# EAGLE schematic sketchy_060426 (EAGLE 4.16)
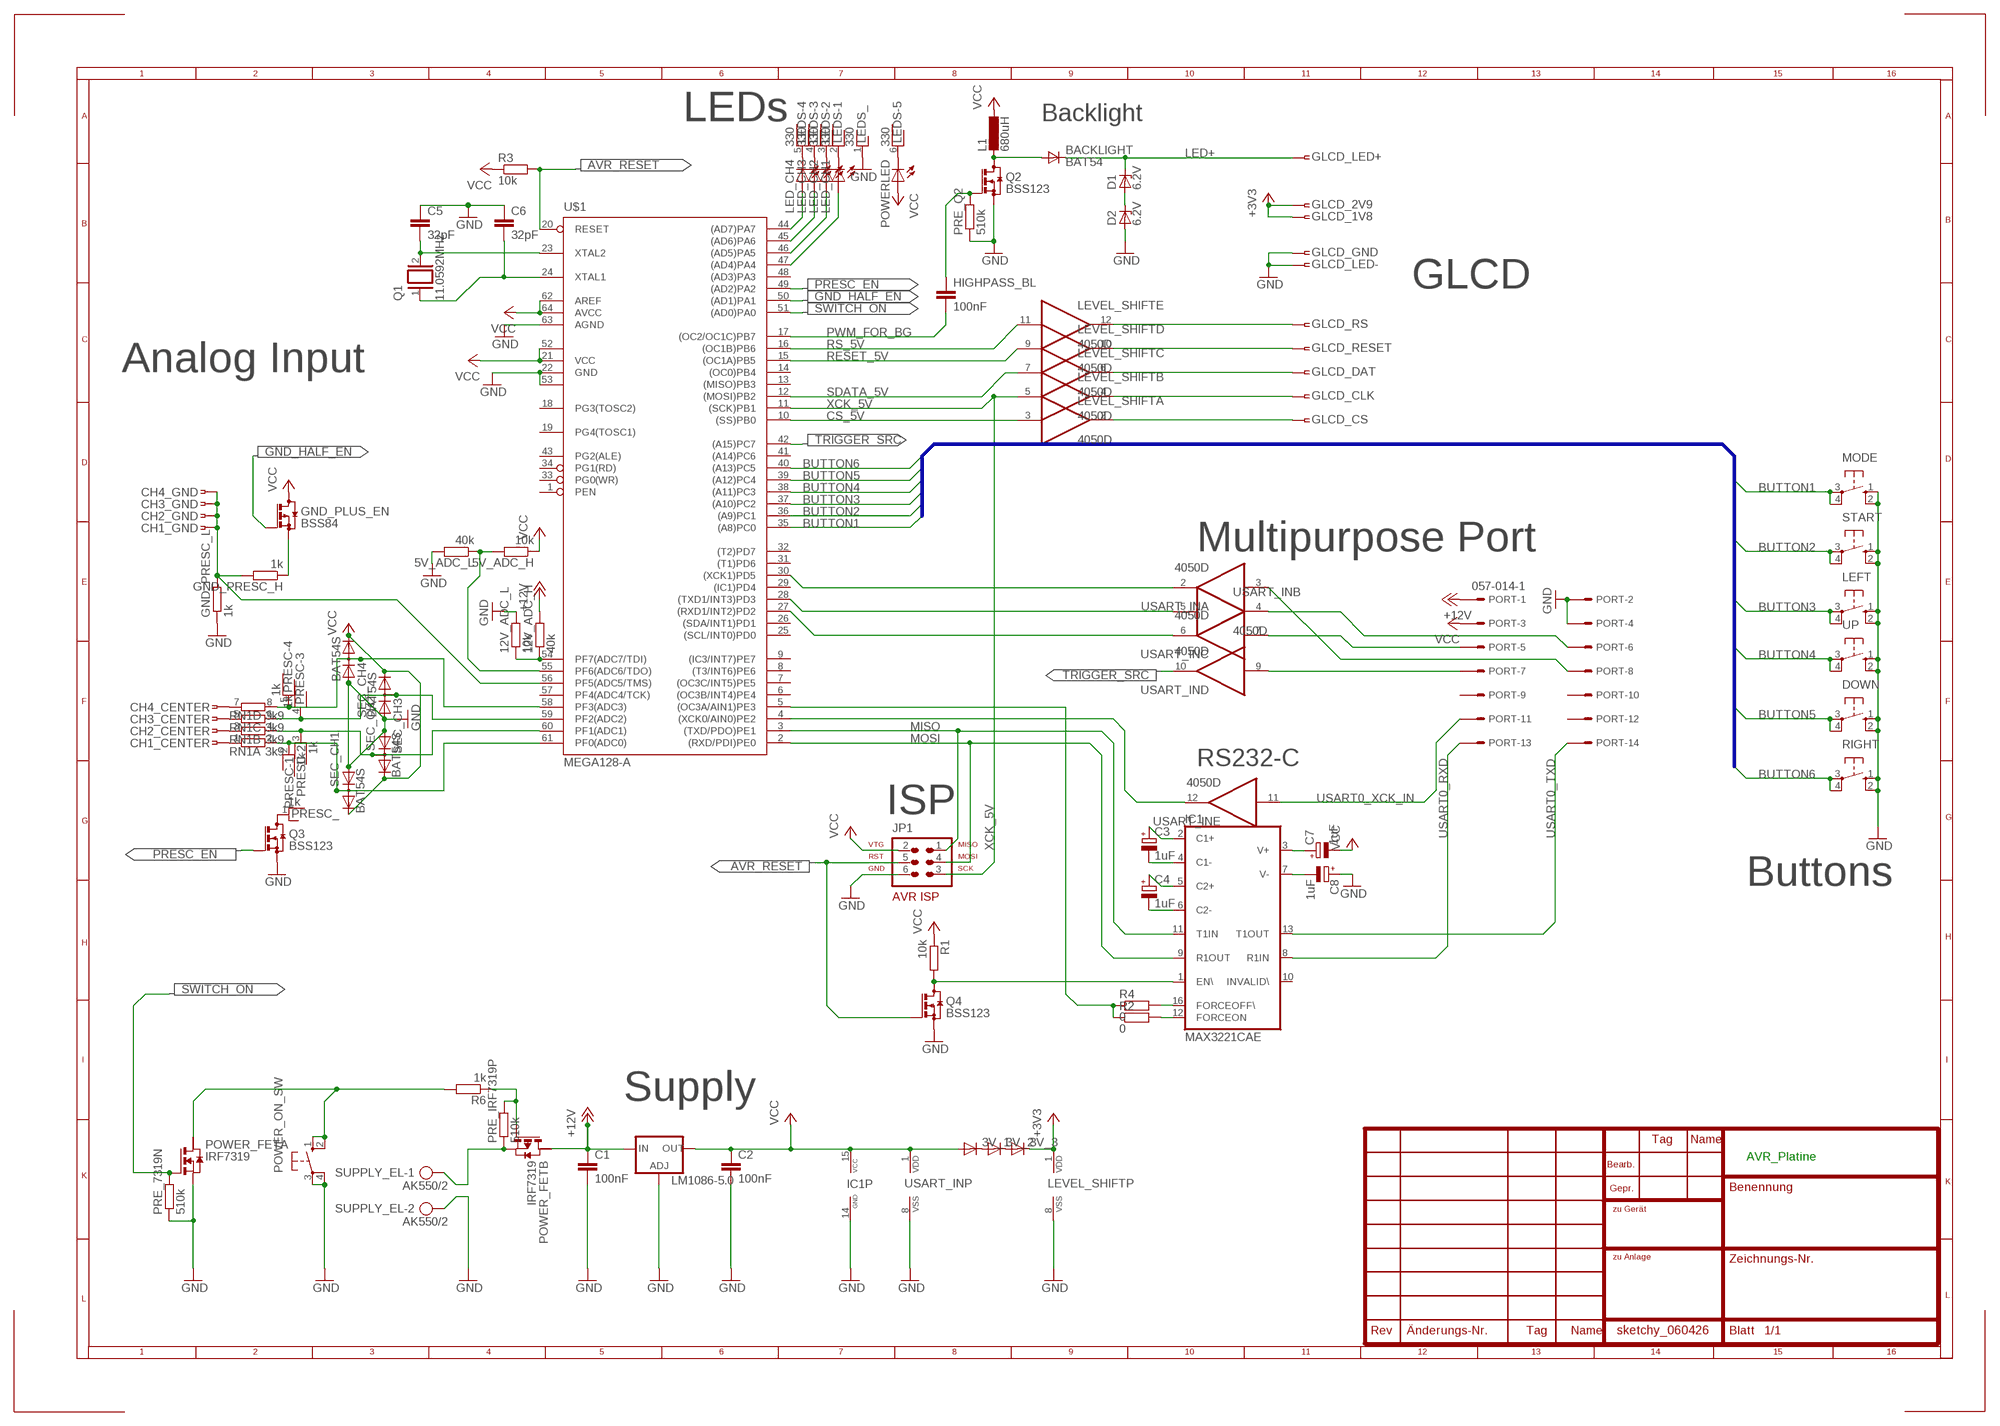
[diagram p0: schematic, sheet 1]

## Parts
3V_1  DIODE-MINIMELF  [MINIMELF]
3V_2  DIODE-MINIMELF  [MINIMELF]
3V_3  DIODE-MINIMELF  [MINIMELF]
5V_ADC_H  10k  R-EU_R0805  [R0805]
5V_ADC_L  40k  R-EU_R0805  [R0805]
12V_ADC_H  40k  R-EU_R0805  [R0805]
12V_ADC_L  10k  R-EU_R0805  [R0805]
BACKLIGHT  BAT54  DSOT23  [SOT-23]
C1  100nF  C-EU050-025X075  [C050-025X075]
C2  100nF  C-EU050-025X075  [C050-025X075]
C3  1uF  CPOL-EU153CLV-0405  [153CLV-0405]
C4  1uF  CPOL-EU153CLV-0405  [153CLV-0405]
C5  32pF  C-EUC0805  [C0805]
C6  32pF  C-EUC0805  [C0805]
C7  1uF  CPOL-EU153CLV-0405  [153CLV-0405]
C8  1uF  CPOL-EU153CLV-0405  [153CLV-0405]
CH1  BNC_GEWINKELT  [BNC]
CH2  BNC_GEWINKELT  [BNC]
CH3  BNC_GEWINKELT  [BNC]
CH4  BNC_GEWINKELT  [BNC]
D1  6.2V  ZENER-DIODESOT23  [SOT23]
D2  6.2V  ZENER-DIODESOT23  [SOT23]
DOWN  10-XX  [B3F-10XX]
GLCD  GLCD_S65  [GLCD_S65]
GND_PLUS_EN  BSS84  [SOT23]
GND_PRESC_H  1k  R-EU_R0805  [R0805]
GND_PRESC_L  1k  R-EU_R0805  [R0805]
HIGHPASS_BL  100nF  C-EU050-025X075  [C050-025X075]
IC1  MAX3221CAE  [SSOP16]
JP1  AVR-ISP-6  [AVR-ISP-6]
L1  680uH  L-EU2200-12.7  [2200-12.7]
LED_CH1  LEDCHIPLED_0805  [CHIPLED_0805]
LED_CH2  LEDCHIPLED_0805  [CHIPLED_0805]
LED_CH3  LEDCHIPLED_0805  [CHIPLED_0805]
LED_CH4  LEDCHIPLED_0805  [CHIPLED_0805]
LEDS  330  RNX5  [RN-6]
LEFT  10-XX  [B3F-10XX]
LEVEL_SHIFT  4050D  [SO16]
LM1086-5.0  LM317TL  [317TL]
MODE  10-XX  [B3F-10XX]
PORT  057-014-1  [057-014-1]
POWER_FET  IRF7319  PN_MOSFET-SO8  [SO8]
POWER_ON_SW  10-XX  [B3F-10XX]
POWERLED  LEDCHIPLED_0805  [CHIPLED_0805]
PRE_7319N  510k  R-EU_R0805  [R0805]
PRE_IRF7319P  510k  R-EU_R0805  [R0805]
PRE_Q2  510k  R-EU_R0805  [R0805]
PRESC  1k  RNX4  [RN-5]
Q1  11.0592MHz  XTAL/S  [QS]
Q2  BSS123  [SOT23]
Q3  BSS123  [SOT23]
Q4  BSS123  [SOT23]
R1  10k  R-EU_R0805  [R0805]
R2  0  R-EU_R0805  [R0805]
R3  10k  R-EU_R0805  [R0805]
R4  0  R-EU_R0805  [R0805]
R6  1k  R-EU_R0805  [R0805]
RIGHT  10-XX  [B3F-10XX]
RN1  3k9  E4R  [SIL8]
SEC_CH1  BAT54S  DIODE_2CACA-SOT23  [SOT23]
SEC_CH2  BAT54S  DIODE_2CACA-SOT23  [SOT23]
SEC_CH3  BAT54S  DIODE_2CACA-SOT23  [SOT23]
SEC_CH4  BAT54S  DIODE_2CACA-SOT23  [SOT23]
START  10-XX  [B3F-10XX]
SUPPLY_EL  AK550/2  [AK550/2]
U$1  MEGA128-A  [TQFP64]
UP  10-XX  [B3F-10XX]
USART_IN  4050D  [SO16]

## Nets
+3V3: 3V_3.C GLCD.6 GLCD.8 LEVEL_SHIFT.1(P:VDD)
+12V: 12V_ADC_H.2 C1.1 LM1086-5.0.3(IN) PORT.1 POWER_FET.5(B:D)
AVR_RESET: JP1.5 Q4.1(G) R3.2 U$1.20(RESET)
BUTTON1: MODE.3(P) MODE.4(P1) U$1.35((A8)PC0)
BUTTON2: START.3(P) START.4(P1) U$1.36((A9)PC1)
BUTTON3: LEFT.3(P) LEFT.4(P1) U$1.37((A10)PC2)
BUTTON4: U$1.38((A11)PC3) UP.3(P) UP.4(P1)
BUTTON5: DOWN.3(P) DOWN.4(P1) U$1.39((A12)PC4)
BUTTON6: RIGHT.3(P) RIGHT.4(P1) U$1.40((A13)PC5)
CS_5V: LEVEL_SHIFT.3(A:I) U$1.10((SS)PB0)
GND: 5V_ADC_L.2 12V_ADC_L.2 C1.2 C2.2 C5.1 C6.1 C8.+ D2.1(A) DOWN.1(S) DOWN.2(S1) GLCD.7 GLCD.10 GND_PRESC_L.1 IC1.14(GND) JP1.6 LEDS.1 LEFT.1(S) LEFT.2(S1) LEVEL_SHIFT.8(P:VSS) LM1086-5.0.1(ADJ) MODE.1(S) MODE.2(S1) PORT.2 PORT.4 POWER_FET.1(A:S) POWER_ON_SW.3(P) POWER_ON_SW.4(P1) PRE_7319N.1 PRE_Q2.1 Q2.2(S) Q3.2(S) Q4.2(S) RIGHT.1(S) RIGHT.2(S1) SEC_CH1.1(A) SEC_CH2.1(A) SEC_CH3.1(A) SEC_CH4.1(A) START.1(S) START.2(S1) SUPPLY_EL.2 U$1.22(GND) U$1.53(GND1) U$1.63(AGND) UP.1(S) UP.2(S1) USART_IN.8(P:VSS)
GND_HALF_EN: GND_PLUS_EN.1(G) U$1.50((AD1)PA1)
LED+: BACKLIGHT.1(C) D1.3(C) GLCD.9
MISO: IC1.11(T1IN) JP1.1 U$1.3((TXD/PDO)PE1)
MOSI: IC1.9(R1OUT) JP1.4 U$1.2((RXD/PDI)PE0)
N$1: CH1.CENTER RN1.1
N$2: 12V_ADC_H.1 12V_ADC_L.1 U$1.54(PF7(ADC7/TDI))
N$3: BACKLIGHT.3(A) L1.2 Q2.3(D)
N$4: LEDS.6 POWERLED.C
N$5: D1.1(A) D2.3(C)
N$6: 3V_1.C 3V_2.A
N$7: 3V_2.C 3V_3.A
N$8: C8.- IC1.7(V-)
N$9: POWER_FET.4(B:G) PRE_IRF7319P.2 R6.1
N$10: C5.2 Q1.2 U$1.23(XTAL2)
N$11: C6.2 Q1.1 U$1.24(XTAL1)
N$12: GND_PLUS_EN.2(S) GND_PRESC_H.1
N$13: U$1.30((XCK1)PD5) USART_IN.2(A:O)
N$14: CH2.CENTER RN1.3
N$15: POWER_FET.3(B:S) PRE_IRF7319P.1 SUPPLY_EL.1
N$16: U$1.28((TXD1/INT3)PD3) USART_IN.5(B:I)
N$17: U$1.27((RXD1/INT2)PD2) USART_IN.6(C:O)
N$18: GLCD.1 LEVEL_SHIFT.12(E:O)
N$19: GLCD.2 LEVEL_SHIFT.10(D:O)
N$20: GLCD.3 LEVEL_SHIFT.2(A:O)
N$21: GLCD.4 LEVEL_SHIFT.4(B:O)
N$22: CH3.CENTER RN1.5
N$23: GLCD.5 LEVEL_SHIFT.6(C:O)
N$24: CH4.CENTER RN1.7
N$25: LED_CH1.C LEDS.2
N$26: PRESC.2 RN1.2 SEC_CH1.3(AC) U$1.61(PF0(ADC0))
N$27: PRESC.3 RN1.4 SEC_CH2.3(AC) U$1.60(PF1(ADC1))
N$28: PRESC.4 RN1.6 SEC_CH3.3(AC) U$1.59(PF2(ADC2))
N$29: PRESC.5 RN1.8 SEC_CH4.3(AC) U$1.58(PF3(ADC3))
N$30: PORT.6 USART_IN.4(B:O)
N$31: LED_CH2.C LEDS.3
N$32: PORT.5 USART_IN.7(C:I)
N$33: LED_CH3.C LEDS.4
N$34: PORT.8 USART_IN.3(A:I)
N$35: PORT.7 USART_IN.9(D:I)
N$36: 5V_ADC_H.2 5V_ADC_L.1 U$1.55(PF6(ADC6/TDO))
N$37: LED_CH1.A U$1.47((AD4)PA4)
N$38: LED_CH2.A U$1.46((AD5)PA5)
N$39: LED_CH3.A U$1.45((AD6)PA6)
N$40: LED_CH4.A U$1.44((AD7)PA7)
N$41: LED_CH4.C LEDS.5
N$42: POWER_FET.7(A:D) POWER_ON_SW.1(S) POWER_ON_SW.2(S1) R6.2
N$43: PRESC.1 Q3.3(D)
N$44: CH1.GND CH2.GND CH3.GND CH4.GND GND_PRESC_H.2 GND_PRESC_L.2 U$1.56(PF5(ADC5/TMS))
N$45: C3.+ IC1.2(C1+)
N$46: C3.- IC1.4(C1-)
N$47: C4.+ IC1.5(C2+)
N$48: C4.- IC1.6(C2-)
N$49: C7.+ IC1.3(V+)
N$50: IC1.1(EN\) Q4.3(D) R1.2
N$51: HIGHPASS_BL.1 PRE_Q2.2 Q2.1(G)
N$53: IC1.12(FORCEON) R2.2
N$54: U$1.4((XCK0/AIN0)PE2) USART_IN.12(E:O)
N$55: IC1.16(FORCEOFF\) R4.2
N$56: R2.1 R4.1 U$1.5((OC3A/AIN1)PE3)
PRESC_EN: Q3.1(G) U$1.49((AD2)PA2)
PWM_FOR_BG: HIGHPASS_BL.2 U$1.17((OC2/OC1C)PB7)
RESET_5V: LEVEL_SHIFT.9(D:I) U$1.15((OC1A)PB5)
RS_5V: LEVEL_SHIFT.11(E:I) U$1.16((OC1B)PB6)
SDATA_5V: LEVEL_SHIFT.7(C:I) U$1.12((MOSI)PB2)
SWITCH_ON: POWER_FET.2(A:G) PRE_7319N.2 U$1.51((AD0)PA0)
TRIGGER_SRC: U$1.42((A15)PC7) USART_IN.10(D:O)
USART0_RXD: IC1.8(R1IN) PORT.13
USART0_TXD: IC1.13(T1OUT) PORT.14
USART0_XCK_IN: PORT.11 USART_IN.11(E:I)
VCC: 3V_1.A 5V_ADC_H.1 C2.1 C7.- GND_PLUS_EN.3(D) IC1.15(VCC) JP1.2 L1.1 LM1086-5.0.2(OUT) PORT.3 POWERLED.A R1.1 R3.1 SEC_CH1.2(C) SEC_CH2.2(C) SEC_CH3.2(C) SEC_CH4.2(C) U$1.21(VCC) U$1.52(VCC1) U$1.62(AREF) U$1.64(AVCC) USART_IN.1(P:VDD)
XCK_5V: JP1.3 LEVEL_SHIFT.5(B:I) U$1.11((SCK)PB1)
Unconnected: IC1.10(INVALID\) LEVEL_SHIFT.14(F:I) LEVEL_SHIFT.15(F:O) PORT.9 PORT.10 PORT.12 POWER_FET.6(B:D2) POWER_FET.8(A:D2) U$1.1(PEN) U$1.6((OC3B/INT4)PE4) U$1.7((OC3C/INT5)PE5) U$1.8((T3/INT6)PE6) U$1.9((IC3/INT7)PE7) U$1.13((MISO)PB3) U$1.14((OC0)PB4) U$1.18(PG3(TOSC2)) U$1.19(PG4(TOSC1)) U$1.25((SCL/INT0)PD0) U$1.26((SDA/INT1)PD1) U$1.29((IC1)PD4) U$1.31((T1)PD6) U$1.32((T2)PD7) U$1.33(PG0(WR)) U$1.34(PG1(RD)) U$1.41((A14)PC6) U$1.43(PG2(ALE)) U$1.48((AD3)PA3) U$1.57(PF4(ADC4/TCK)) USART_IN.14(F:I) USART_IN.15(F:O)

## Buses
BUTTON[1..6]

## Notes on the sheet
- LEDs | Backlight
- GLCD
- Analog Input
- Multipurpose Port
- RS232-C
- ISP
- Buttons
- Supply
- AVR_Platine

## Library data of the parts
3V_1-3V_3 = diode:DIODE-: DIODE
5V_ADC_H 5V_ADC_L 12V_ADC_H 12V_ADC_L GND_PRESC_H GND_PRESC_L PRE_7319N PRE_IRF7319P PRE_Q2 R1-R4 R6 = rcl:R-EU_: RESISTOR, European symbol
BACKLIGHT = zetex:D: DIODE
C1 C2 C5 C6 HIGHPASS_BL = rcl:C-EU: CAPACITOR, European symbol
C3 C4 C7 C8 = rcl:CPOL-EU: POLARIZED CAPACITOR, European symbol
CH1-CH4 = zween:BNC_GEWINKELT
D1 D2 = diode:ZENER-DIODE: Z-Diode
DOWN LEFT MODE POWER_ON_SW RIGHT START UP = switch-omron:10-XX: OMRON SWITCH
GLCD = zween:GLCD_S65: package for GLCD from Siemens S65
GND_PLUS_EN = transistor-small-signal:BSS84: P-CHANNEL MOS FET
IC1 = maxim:MAX3221*: RS-232 Transceivers with AutoShutdown 1µA Supply-Current, True +3V to +5.5V http://dbserv.maxim-ic.com/
JP1 = atmel:AVR-ISP-6: AVR ISP-6 Serial Programming Header
L1 = rcl:L-EU: INDUCTOR, European symbol
LED_CH1-LED_CH4 POWERLED = led:LED: LED OSRAM: - CHIPLED LG R971, LG N971, LY N971, LG Q971, LY Q971, LO R971, LY R971 LH N974, LH R974 LS Q976, LO Q976, LY Q976 LO Q996 - Hyper CHIPLED LW Q18S LB Q993, LB Q99A, LB R99A - SideLED LS A670, LO A670, LY A670, LG A670, LP A670 LB A673, LV A673, LT A673, LW A673 LH A674 LY A675 LS A676, LA A676, LO A676, LY A676, LW A676 LS A679, LY A679, LG A679 - Hyper Micro SIDELED® LS Y876, LA Y876, LO Y876, LY Y876 LT Y87S - SmartLED LW L88C, LW L88S LB L89C, LB L89S, LG L890 LS L89K, LO L89K, LY L89K LS L896, LA L896, LO L896, LY L896 - TOPLED LS T670, LO T670, LY T670, LG T670, LP T670 LSG T670, LSP T670, LSY T670, LOP T670, LYG T670 LG T671, LOG T671, LSG T671 LB T673, LV T673, LT T673, LW T673 LH T674 LS T676, LA T676, LO T676, LY T676, LB T676, LH T676, LSB T676, LW T676 LB T67C, LV T67C, LT T67C, LS T67K, LO T67K, LY T67K, LW E67C LS E67B, LA E67B, LO E67B, LY E67B, LB E67C, LV E67C, LT E67C LW T67C LS T679, LY T679, LG T679 LS T770, LO T770, LY T770, LG T770, LP T770 LB T773, LV T773, LT T773, LW T773 LH T774 LS E675, LA E675, LY E675, LS T675 LS T776, LA T776, LO T776, LY T776, LB T776 LHGB T686 LT T68C, LB T68C - Hyper Mini TOPLED® LB M676 - Mini TOPLED Santana® LG M470 LS M47K, LO M47K, LY M47K Source: http://www.osram.convergy.de/
LEDS = resistor-net:RNX5: RESISTOR NETWORK
LEVEL_SHIFT USART_IN = 40xx:4050: Hex non-inverting BUFFER
LM1086-5.0 = v-reg:LM317TL: VOLTAGE REGULATOR
PORT = con-panduit:057-014-: CONNECTOR 10-pin series 057 contact pc board low profile headers
POWER_FET = zetex:PN_MOSFET-: DUAL N AND P-CHANNEL ENHANCEMENT MODE MOSFET source ZXMD63C02.pdf from http://www.zetex.com/
PRESC = resistor-net:RNX4: RESISTOR NETWORK
Q1 = special:XTAL/S: CRYSTAL
Q2-Q4 = transistor-small-signal:BSS123: N-CHANNEL MOS FET
RN1 = resistor-sil:E4R: SIL RESISTOR
SEC_CH1-SEC_CH4 = diode:DIODE_2CACA-: 2 Diodes - Cathode-Anode|Cathode-Anode
SUPPLY_EL = con-ptr500:AK550/2: CONNECTOR
U$1 = avr:MEGA128: MICROCONTROLLER 128 Kbytes FLASH 4 Kbytes SRAM 4 Kbytes EEPROM DUAL USART 8-channel 10 bit ADC

## Net classes
1 motorsupply: width 1.016 mm, drill 1.016 mm